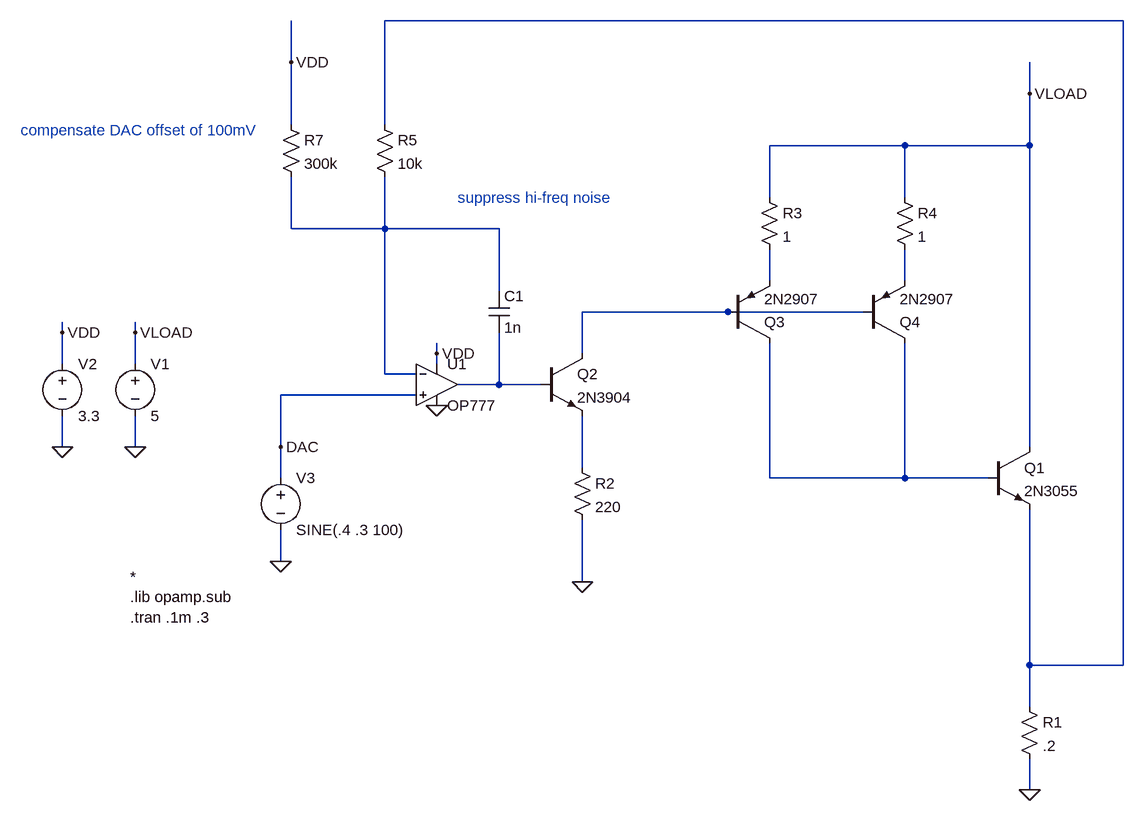
[diagram p0: schematic batmet.asc]
batmet.asc, the LTspice schematic file:
Version 4
SHEET 1 1892 1056
WIRE 1520 -304 384 -304
WIRE 240 -240 240 -304
WIRE 1376 -192 1376 -240
WIRE 240 -144 240 -240
WIRE 384 -144 384 -304
WIRE 1184 -112 976 -112
WIRE 1376 -112 1376 -192
WIRE 1376 -112 1184 -112
WIRE 976 -32 976 -112
WIRE 1184 -32 1184 -112
WIRE 240 16 240 -64
WIRE 384 16 384 -64
WIRE 384 16 240 16
WIRE 560 16 384 16
WIRE 976 96 976 48
WIRE 1184 96 1184 48
WIRE 560 112 560 16
WIRE 912 144 688 144
WIRE 1120 144 912 144
WIRE -112 176 -112 160
WIRE 0 176 0 160
WIRE 464 208 464 192
WIRE 688 208 688 144
WIRE -112 224 -112 176
WIRE 0 224 0 176
WIRE 464 224 464 208
WIRE 384 240 384 16
WIRE 432 240 384 240
WIRE 560 256 560 176
WIRE 560 256 496 256
WIRE 624 256 560 256
WIRE 432 272 224 272
WIRE -112 352 -112 304
WIRE 0 352 0 304
WIRE 224 352 224 272
WIRE 1376 352 1376 -112
WIRE 688 384 688 304
WIRE 224 400 224 352
WIRE 976 400 976 192
WIRE 1184 400 1184 192
WIRE 1184 400 976 400
WIRE 1312 400 1184 400
WIRE 224 528 224 480
WIRE 688 560 688 464
WIRE 1376 688 1376 448
WIRE 1520 688 1520 -304
WIRE 1520 688 1376 688
WIRE 1376 752 1376 688
WIRE 1376 880 1376 832
FLAG 1376 880 0
FLAG 0 352 0
FLAG 0 176 VLOAD
FLAG -112 352 0
FLAG -112 176 VDD
FLAG 224 528 0
FLAG 224 352 DAC
FLAG 464 288 0
FLAG 464 208 VDD
FLAG 688 560 0
FLAG 1376 -192 VLOAD
FLAG 240 -240 VDD
SYMBOL res 1360 736 R0
SYMATTR InstName R1
SYMATTR Value .2
SYMBOL npn 1312 352 R0
SYMATTR InstName Q1
SYMATTR Value 2N3055
SYMBOL voltage 0 208 R0
SYMATTR InstName V1
SYMATTR Value 5
SYMBOL voltage -112 208 R0
SYMATTR InstName V2
SYMATTR Value 3.3
SYMBOL voltage 224 384 R0
SYMATTR InstName V3
SYMATTR Value SINE(.4 .3 100)
SYMBOL Opamps/OP777 464 192 R0
SYMATTR InstName U1
SYMBOL pnp 912 192 M180
SYMATTR InstName Q3
SYMATTR Value 2N2907
SYMBOL pnp 1120 192 M180
SYMATTR InstName Q4
SYMATTR Value 2N2907
SYMBOL npn 624 208 R0
SYMATTR InstName Q2
SYMATTR Value 2N3904
SYMBOL res 960 -48 R0
SYMATTR InstName R3
SYMATTR Value 1
SYMBOL res 1168 -48 R0
SYMATTR InstName R4
SYMATTR Value 1
SYMBOL res 672 368 R0
SYMATTR InstName R2
SYMATTR Value 220
SYMBOL cap 544 112 R0
SYMATTR InstName C1
SYMATTR Value 1n
SYMBOL res 368 -160 R0
SYMATTR InstName R5
SYMATTR Value 10k
SYMBOL res 224 -160 R0
SYMATTR InstName R7
SYMATTR Value 300k
TEXT -8 552 Left 2 !*\n.lib opamp.sub\n.tran .1m .3
TEXT 496 -32 Left 2 ;suppress hi-freq noise
TEXT -176 -136 Left 2 ;compensate DAC offset of 100mV

The netlist it stands for:
* batmet.asc
R1 N001 0 .2
Q1 VLOAD N008 N001 0 2N3055
V1 VLOAD 0 5
V2 VDD 0 3.3
V3 DAC 0 SINE(.4 .3 100)
XU1 DAC N002 VDD 0 N006 OP777  ; pins In+ In- V+ V- OUT
Q3 N008 N005 N003 0 2N2907
Q4 N008 N005 N004 0 2N2907
Q2 N005 N006 N007 0 2N3904
R3 VLOAD N003 1
R4 VLOAD N004 1
R2 N007 0 220
C1 N002 N006 1n
R5 N001 N002 10k
R7 VDD N002 300k
.model NPN NPN
.model PNP PNP
.lib standard.bjt
*
.lib opamp.sub
.tran .1m .3
* suppress hi-freq noise
* compensate DAC offset of 100mV
.lib ADI.lib
.backanno
.end